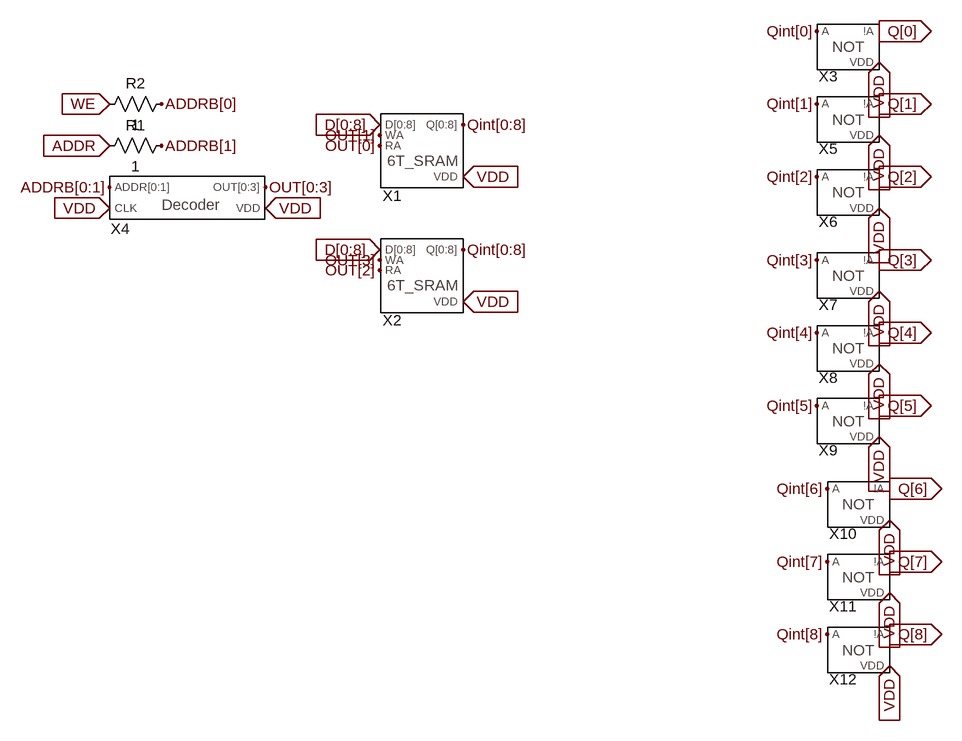
[diagram p0: schematic SRAM.asc]
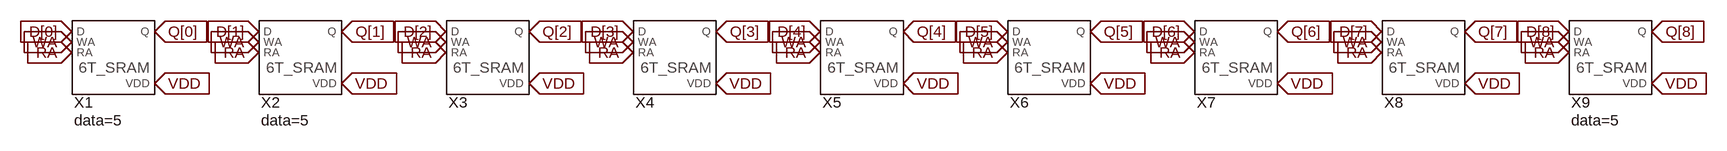
[diagram p1: sub-circuit 6tsram[9].asc]
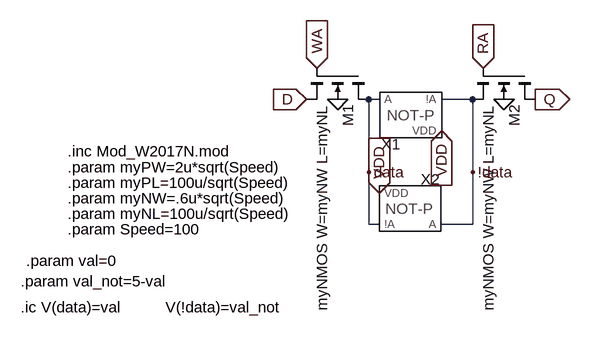
[diagram p2: sub-circuit 6tsram.asc]
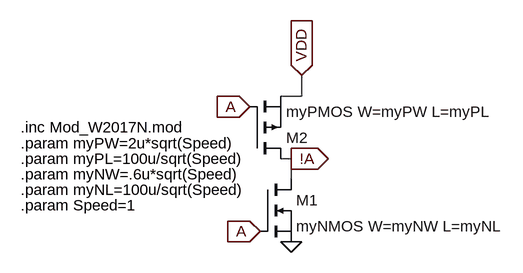
[diagram p3: sub-circuit gate_not_param.asc]
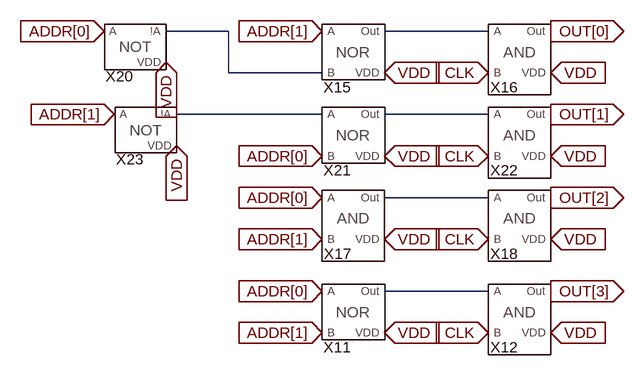
[diagram p4: sub-circuit decoder.asc]
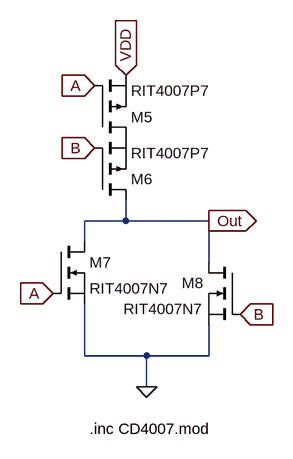
[diagram p5: sub-circuit gate_nor.asc]
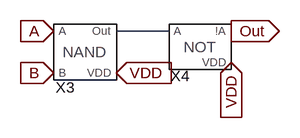
[diagram p6: sub-circuit gate_and.asc]
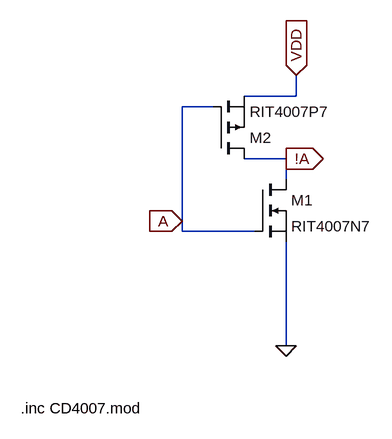
[diagram p7: sub-circuit gate_not.asc]
SRAM.asc, the LTspice schematic file:
Version 4
SHEET 1 1788 680
FLAG 64 -272 VDD
IOPIN 64 -272 In
FLAG 64 -464 VDD
IOPIN 64 -464 In
FLAG -64 -544 D[0:8]
IOPIN -64 -544 In
FLAG -64 -352 D[0:8]
IOPIN -64 -352 In
FLAG 64 -544 Qint[0:8]
FLAG 64 -352 Qint[0:8]
FLAG -480 -448 ADDRB[0:1]
FLAG -400 -512 ADDRB[1]
FLAG -400 -576 ADDRB[0]
FLAG -240 -448 OUT[0:3]
FLAG -240 -416 VDD
IOPIN -240 -416 In
FLAG -480 -576 WE
IOPIN -480 -576 In
FLAG -480 -416 VDD
IOPIN -480 -416 In
FLAG -480 -512 ADDR
IOPIN -480 -512 In
FLAG -64 -528 OUT[1]
FLAG -64 -512 OUT[0]
FLAG -64 -336 OUT[3]
FLAG -64 -320 OUT[2]
FLAG 704 -640 VDD
IOPIN 704 -640 In
FLAG 608 -688 Qint[0]
FLAG 704 -688 Q[0]
IOPIN 704 -688 Out
FLAG 704 -528 VDD
IOPIN 704 -528 In
FLAG 608 -576 Qint[1]
FLAG 704 -576 Q[1]
IOPIN 704 -576 Out
FLAG 704 -416 VDD
IOPIN 704 -416 In
FLAG 608 -464 Qint[2]
FLAG 704 -464 Q[2]
IOPIN 704 -464 Out
FLAG 704 -288 VDD
IOPIN 704 -288 In
FLAG 608 -336 Qint[3]
FLAG 704 -336 Q[3]
IOPIN 704 -336 Out
FLAG 704 -176 VDD
IOPIN 704 -176 In
FLAG 608 -224 Qint[4]
FLAG 704 -224 Q[4]
IOPIN 704 -224 Out
FLAG 704 -64 VDD
IOPIN 704 -64 In
FLAG 608 -112 Qint[5]
FLAG 704 -112 Q[5]
IOPIN 704 -112 Out
FLAG 720 64 VDD
IOPIN 720 64 In
FLAG 624 16 Qint[6]
FLAG 720 16 Q[6]
IOPIN 720 16 Out
FLAG 720 176 VDD
IOPIN 720 176 In
FLAG 624 128 Qint[7]
FLAG 720 128 Q[7]
IOPIN 720 128 Out
FLAG 720 288 VDD
IOPIN 720 288 In
FLAG 624 240 Qint[8]
FLAG 720 240 Q[8]
IOPIN 720 240 Out
SYMBOL 6TSRAM[9] -16 -512 R0
SYMATTR InstName X1
SYMBOL 6TSRAM[9] -16 -320 R0
SYMATTR InstName X2
SYMBOL Decoder -432 -416 R0
SYMATTR InstName X4
SYMBOL res -384 -528 R90
WINDOW 0 0 56 VBottom 2
WINDOW 3 32 56 VTop 2
SYMATTR InstName R1
SYMATTR Value 1
SYMBOL res -384 -592 R90
WINDOW 0 0 56 VBottom 2
WINDOW 3 32 56 VTop 2
SYMATTR InstName R2
SYMATTR Value 1
SYMBOL Gate_NOT 656 -656 R0
SYMATTR InstName X3
SYMBOL Gate_NOT 656 -544 R0
SYMATTR InstName X5
SYMBOL Gate_NOT 656 -432 R0
SYMATTR InstName X6
SYMBOL Gate_NOT 656 -304 R0
SYMATTR InstName X7
SYMBOL Gate_NOT 656 -192 R0
SYMATTR InstName X8
SYMBOL Gate_NOT 656 -80 R0
SYMATTR InstName X9
SYMBOL Gate_NOT 672 48 R0
SYMATTR InstName X10
SYMBOL Gate_NOT 672 160 R0
SYMATTR InstName X11
SYMBOL Gate_NOT 672 272 R0
SYMATTR InstName X12

6tsram[9].asc, the sub-circuit schematic file:
Version 4
SHEET 1 1796 680
FLAG -624 -272 VDD
IOPIN -624 -272 In
FLAG -624 -352 Q[0]
IOPIN -624 -352 In
FLAG -752 -352 D[0]
IOPIN -752 -352 In
FLAG -752 -336 WA
IOPIN -752 -336 In
FLAG -752 -320 RA
IOPIN -752 -320 In
FLAG -336 -272 VDD
IOPIN -336 -272 In
FLAG -336 -352 Q[1]
IOPIN -336 -352 In
FLAG -464 -352 D[1]
IOPIN -464 -352 In
FLAG -464 -336 WA
IOPIN -464 -336 In
FLAG -464 -320 RA
IOPIN -464 -320 In
FLAG -48 -272 VDD
IOPIN -48 -272 In
FLAG -48 -352 Q[2]
IOPIN -48 -352 In
FLAG -176 -352 D[2]
IOPIN -176 -352 In
FLAG -176 -336 WA
IOPIN -176 -336 In
FLAG -176 -320 RA
IOPIN -176 -320 In
FLAG 240 -272 VDD
IOPIN 240 -272 In
FLAG 240 -352 Q[3]
IOPIN 240 -352 In
FLAG 112 -352 D[3]
IOPIN 112 -352 In
FLAG 112 -336 WA
IOPIN 112 -336 In
FLAG 112 -320 RA
IOPIN 112 -320 In
FLAG 528 -272 VDD
IOPIN 528 -272 In
FLAG 528 -352 Q[4]
IOPIN 528 -352 In
FLAG 400 -352 D[4]
IOPIN 400 -352 In
FLAG 400 -336 WA
IOPIN 400 -336 In
FLAG 400 -320 RA
IOPIN 400 -320 In
FLAG 816 -272 VDD
IOPIN 816 -272 In
FLAG 816 -352 Q[5]
IOPIN 816 -352 In
FLAG 688 -352 D[5]
IOPIN 688 -352 In
FLAG 688 -336 WA
IOPIN 688 -336 In
FLAG 688 -320 RA
IOPIN 688 -320 In
FLAG 1104 -272 VDD
IOPIN 1104 -272 In
FLAG 1104 -352 Q[6]
IOPIN 1104 -352 In
FLAG 976 -352 D[6]
IOPIN 976 -352 In
FLAG 976 -336 WA
IOPIN 976 -336 In
FLAG 976 -320 RA
IOPIN 976 -320 In
FLAG 1392 -272 VDD
IOPIN 1392 -272 In
FLAG 1392 -352 Q[7]
IOPIN 1392 -352 In
FLAG 1264 -352 D[7]
IOPIN 1264 -352 In
FLAG 1264 -336 WA
IOPIN 1264 -336 In
FLAG 1264 -320 RA
IOPIN 1264 -320 In
FLAG 1680 -272 VDD
IOPIN 1680 -272 In
FLAG 1680 -352 Q[8]
IOPIN 1680 -352 In
FLAG 1552 -352 D[8]
IOPIN 1552 -352 In
FLAG 1552 -336 WA
IOPIN 1552 -336 In
FLAG 1552 -320 RA
IOPIN 1552 -320 In
SYMBOL 6TSRAM -704 -320 R0
WINDOW 39 -44 105 Left 2
SYMATTR InstName X1
SYMATTR SpiceLine data=5
SYMBOL 6TSRAM -416 -320 R0
WINDOW 39 -44 105 Left 2
SYMATTR InstName X2
SYMATTR SpiceLine data=5
SYMBOL 6TSRAM -128 -320 R0
SYMATTR InstName X3
SYMBOL 6TSRAM 160 -320 R0
SYMATTR InstName X4
SYMBOL 6TSRAM 448 -320 R0
SYMATTR InstName X5
SYMBOL 6TSRAM 736 -320 R0
SYMATTR InstName X6
SYMBOL 6TSRAM 1024 -320 R0
SYMATTR InstName X7
SYMBOL 6TSRAM 1312 -320 R0
SYMATTR InstName X8
SYMBOL 6TSRAM 1600 -320 R0
WINDOW 39 -44 105 Left 2
SYMATTR InstName X9
SYMATTR SpiceLine data=5

6tsram.asc, the sub-circuit schematic file:
Version 4
SHEET 1 880 680
WIRE 16 -64 0 -64
WIRE 160 -64 112 -64
WIRE 0 48 0 -64
WIRE 160 48 160 -64
WIRE 0 128 0 48
WIRE 16 128 0 128
WIRE 160 128 160 48
WIRE 160 128 112 128
FLAG 112 -16 VDD
IOPIN 112 -16 In
FLAG 16 80 VDD
IOPIN 16 80 In
FLAG 256 -64 Q
IOPIN 256 -64 Out
FLAG 208 -64 0
FLAG -48 -64 0
FLAG -80 -112 WA
IOPIN -80 -112 In
FLAG 176 -112 RA
IOPIN 176 -112 In
FLAG -96 -64 D
IOPIN -96 -64 In
FLAG 0 48 data
FLAG 160 48 !data
SYMBOL Gate_NOT_PARAM 64 -32 R0
SYMATTR InstName X1
SYMBOL Gate_NOT_PARAM 64 96 R180
SYMATTR InstName X2
SYMBOL nmos4 0 -112 R90
SYMATTR InstName M1
SYMATTR Value myNMOS W=myNW L=myNL
SYMBOL nmos4 256 -112 R90
SYMATTR InstName M2
SYMATTR Value myNMOS W=myNW L=myNL
TEXT -464 16 Left 2 !.inc Mod_W2017N.mod
TEXT -464 40 Left 2 !.param myPW=2u*sqrt(Speed)
TEXT -464 64 Left 2 !.param myPL=100u/sqrt(Speed)
TEXT -464 88 Left 2 !.param myNW=.6u*sqrt(Speed)
TEXT -464 112 Left 2 !.param myNL=100u/sqrt(Speed)
TEXT -464 136 Left 2 !.param Speed=100
TEXT -536 216 Left 2 !.param val_not=5-val
TEXT -536 256 Left 2 !.ic V(data)=val          V(!data)=val_not
TEXT -528 184 Left 2 !.param val=0

gate_not_param.asc, the sub-circuit schematic file:
Version 4
SHEET 1 880 680
WIRE 64 -112 64 -144
WIRE 64 -112 32 -112
WIRE 48 -16 32 -16
WIRE 48 16 48 -16
FLAG 48 -16 !A
IOPIN 48 -16 Out
FLAG 64 -144 VDD
IOPIN 64 -144 In
FLAG 48 112 0
FLAG 0 96 A
IOPIN 0 96 In
FLAG -16 -96 A
IOPIN -16 -96 In
SYMBOL nmos 0 16 R0
SYMATTR InstName M1
SYMATTR Value myNMOS W=myNW L=myNL
SYMBOL pmos -16 -16 M180
SYMATTR InstName M2
SYMATTR Value myPMOS W=myPW L=myPL
TEXT -368 -64 Left 2 !.inc Mod_W2017N.mod
TEXT -368 -40 Left 2 !.param myPW=2u*sqrt(Speed)
TEXT -368 -16 Left 2 !.param myPL=100u/sqrt(Speed)
TEXT -368 8 Left 2 !.param myNW=.6u*sqrt(Speed)
TEXT -368 32 Left 2 !.param myNL=100u/sqrt(Speed)
TEXT -368 56 Left 2 !.param Speed=1

decoder.asc, the sub-circuit schematic file:
Version 4
SHEET 1 1132 1208
WIRE -688 112 -784 112
WIRE -288 112 -448 112
WIRE -688 176 -688 112
WIRE -544 176 -688 176
WIRE -544 240 -768 240
WIRE -288 240 -448 240
WIRE -288 368 -448 368
WIRE -288 512 -448 512
FLAG -544 512 ADDR[0]
IOPIN -544 512 In
FLAG -544 576 ADDR[1]
IOPIN -544 576 In
FLAG -448 576 VDD
IOPIN -448 576 In
FLAG -288 576 CLK
IOPIN -288 576 In
FLAG -192 576 VDD
IOPIN -192 576 In
FLAG -544 112 ADDR[1]
IOPIN -544 112 In
FLAG -880 112 ADDR[0]
IOPIN -880 112 In
FLAG -784 160 VDD
IOPIN -784 160 In
FLAG -288 176 CLK
IOPIN -288 176 In
FLAG -192 176 VDD
IOPIN -192 176 In
FLAG -544 368 ADDR[0]
IOPIN -544 368 In
FLAG -544 432 ADDR[1]
IOPIN -544 432 In
FLAG -448 432 VDD
IOPIN -448 432 In
FLAG -288 432 CLK
IOPIN -288 432 In
FLAG -192 432 VDD
IOPIN -192 432 In
FLAG -864 240 ADDR[1]
IOPIN -864 240 In
FLAG -544 304 ADDR[0]
IOPIN -544 304 In
FLAG -768 288 VDD
IOPIN -768 288 In
FLAG -288 304 CLK
IOPIN -288 304 In
FLAG -192 304 VDD
IOPIN -192 304 In
FLAG -448 304 VDD
IOPIN -448 304 In
FLAG -448 176 VDD
IOPIN -448 176 In
FLAG -192 512 OUT[3]
IOPIN -192 512 Out
FLAG -192 112 OUT[0]
IOPIN -192 112 Out
FLAG -192 240 OUT[1]
IOPIN -192 240 Out
FLAG -192 368 OUT[2]
IOPIN -192 368 Out
SYMBOL Gate_NOR -496 544 R0
SYMATTR InstName X11
SYMBOL Gate_AND -240 544 R0
SYMATTR InstName X12
SYMBOL Gate_NOR -496 144 R0
SYMATTR InstName X15
SYMBOL Gate_AND -240 144 R0
SYMATTR InstName X16
SYMBOL Gate_AND -240 400 R0
SYMATTR InstName X18
SYMBOL Gate_AND -496 400 R0
SYMATTR InstName X17
SYMBOL Gate_NOT -832 144 R0
SYMATTR InstName X20
SYMBOL Gate_NOR -496 272 R0
SYMATTR InstName X21
SYMBOL Gate_AND -240 272 R0
SYMATTR InstName X22
SYMBOL Gate_NOT -816 272 R0
SYMATTR InstName X23

gate_nor.asc, the sub-circuit schematic file:
Version 4
SHEET 1 880 680
WIRE -656 -80 -656 -112
WIRE -656 -80 -720 -80
WIRE -528 -80 -656 -80
WIRE -720 -48 -720 -80
WIRE -528 -16 -528 -80
WIRE -720 128 -720 48
WIRE -624 128 -720 128
WIRE -528 128 -528 80
WIRE -528 128 -624 128
WIRE -624 176 -624 128
FLAG -656 -304 VDD
IOPIN -656 -304 In
FLAG -528 -80 Out
IOPIN -528 -80 Out
FLAG -704 -288 A
IOPIN -704 -288 In
FLAG -768 32 A
IOPIN -768 32 In
FLAG -480 64 B
IOPIN -480 64 In
FLAG -704 -192 B
IOPIN -704 -192 In
FLAG -624 176 0
SYMBOL pmos -704 -208 M180
SYMATTR InstName M5
SYMATTR Value RIT4007P7
SYMBOL pmos -704 -112 M180
SYMATTR InstName M6
SYMATTR Value RIT4007P7
SYMBOL nmos -768 -48 R0
SYMATTR InstName M7
SYMATTR Value RIT4007N7
SYMBOL nmos -480 -16 M0
SYMATTR InstName M8
SYMATTR Value RIT4007N7
TEXT -712 240 Left 2 !.inc CD4007.mod

gate_and.asc, the sub-circuit schematic file:
Version 4
SHEET 1 880 680
WIRE -144 0 -224 0
FLAG -224 64 VDD
IOPIN -224 64 In
FLAG -48 48 VDD
IOPIN -48 48 In
FLAG -320 64 B
IOPIN -320 64 In
FLAG -320 0 A
IOPIN -320 0 In
FLAG -48 0 Out
IOPIN -48 0 Out
SYMBOL Gate_NAND -272 32 R0
SYMATTR InstName X3
SYMBOL Gate_NOT -96 32 R0
SYMATTR InstName X4

gate_not.asc, the sub-circuit schematic file:
Version 4
SHEET 1 880 680
WIRE 64 -112 64 -144
WIRE 64 -112 -16 -112
WIRE -64 -96 -112 -96
WIRE 48 -16 -16 -16
WIRE 48 16 48 -16
WIRE -112 80 -112 -96
WIRE -112 96 -112 80
WIRE 0 96 -112 96
WIRE 48 272 48 112
FLAG 48 272 0
FLAG -112 80 A
IOPIN -112 80 In
FLAG 48 -16 !A
IOPIN 48 -16 Out
FLAG 64 -144 VDD
IOPIN 64 -144 In
SYMBOL nmos 0 16 R0
SYMATTR InstName M1
SYMATTR Value RIT4007N7
SYMBOL pmos -64 -16 M180
SYMATTR InstName M2
SYMATTR Value RIT4007P7
TEXT -360 368 Left 2 !.inc CD4007.mod

The netlist it stands for:
* SRAM.asc
XX1 D[0] D[1] D[2] D[3] D[4] D[5] D[6] D[7] D[8] VDD Qint[0] Qint[1] Qint[2] Qint[3] Qint[4] Qint[5] Qint[6] Qint[7] Qint[8] OUT[0] OUT[1] 6tsram[9]
XX2 D[0] D[1] D[2] D[3] D[4] D[5] D[6] D[7] D[8] VDD Qint[0] Qint[1] Qint[2] Qint[3] Qint[4] Qint[5] Qint[6] Qint[7] Qint[8] OUT[2] OUT[3] 6tsram[9]
XX4 VDD VDD OUT[0] OUT[1] OUT[2] OUT[3] ADDRB[0] ADDRB[1] decoder
R1 ADDRB[1] ADDR 1
R2 ADDRB[0] WE 1
XX3 Qint[0] VDD Q[0] gate_not
XX5 Qint[1] VDD Q[1] gate_not
XX6 Qint[2] VDD Q[2] gate_not
XX7 Qint[3] VDD Q[3] gate_not
XX8 Qint[4] VDD Q[4] gate_not
XX9 Qint[5] VDD Q[5] gate_not
XX10 Qint[6] VDD Q[6] gate_not
XX11 Qint[7] VDD Q[7] gate_not
XX12 Qint[8] VDD Q[8] gate_not

* block symbol definitions
.subckt 6tsram[9] D[0] D[1] D[2] D[3] D[4] D[5] D[6] D[7] D[8] VDD Q[0] Q[1] Q[2] Q[3] Q[4] Q[5] Q[6] Q[7] Q[8] RA WA
XX1 D[0] VDD Q[0] RA WA 6tsram params: data=5
XX2 D[1] VDD Q[1] RA WA 6tsram params: data=5
XX3 D[2] VDD Q[2] RA WA 6tsram
XX4 D[3] VDD Q[3] RA WA 6tsram
XX5 D[4] VDD Q[4] RA WA 6tsram
XX6 D[5] VDD Q[5] RA WA 6tsram
XX7 D[6] VDD Q[6] RA WA 6tsram
XX8 D[7] VDD Q[7] RA WA 6tsram
XX9 D[8] VDD Q[8] RA WA 6tsram params: data=5
.ends 6tsram[9]

.subckt 6tsram D VDD Q RA WA
XX1 data VDD !data gate_not_param
XX2 !data VDD data gate_not_param
M1 data WA D 0 myNMOS W=myNW L=myNL
M2 Q RA !data 0 myNMOS W=myNW L=myNL
.inc Mod_W2017N.mod
.param myPW=2u*sqrt(Speed)
.param myPL=100u/sqrt(Speed)
.param myNW=.6u*sqrt(Speed)
.param myNL=100u/sqrt(Speed)
.param Speed=100
.param val_not=5-val
.ic V(data)=val          V(!data)=val_not
.param val=0
.ends 6tsram

.subckt gate_not_param A VDD !A
M1 !A A 0 0 myNMOS W=myNW L=myNL
M2 !A A VDD VDD myPMOS W=myPW L=myPL
.inc Mod_W2017N.mod
.param myPW=2u*sqrt(Speed)
.param myPL=100u/sqrt(Speed)
.param myNW=.6u*sqrt(Speed)
.param myNL=100u/sqrt(Speed)
.param Speed=1
.ends gate_not_param

.subckt decoder CLK VDD OUT[0] OUT[1] OUT[2] OUT[3] ADDR[0] ADDR[1]
XX11 ADDR[0] ADDR[1] N006 VDD gate_nor
XX12 N006 CLK OUT[3] VDD gate_and
XX15 ADDR[1] N001 N002 VDD gate_nor
XX16 N002 CLK OUT[0] VDD gate_and
XX18 N005 CLK OUT[2] VDD gate_and
XX17 ADDR[0] ADDR[1] N005 VDD gate_and
XX20 ADDR[0] VDD N001 gate_not
XX21 N003 ADDR[0] N004 VDD gate_nor
XX22 N004 CLK OUT[1] VDD gate_and
XX23 ADDR[1] VDD N003 gate_not
.ends decoder

.subckt gate_nor A B Out VDD
M5 P001 A VDD VDD RIT4007P7
M6 Out B P001 P001 RIT4007P7
M7 Out A 0 0 RIT4007N7
M8 Out B 0 0 RIT4007N7
.inc CD4007.mod
.ends gate_nor

.subckt gate_and A B Out VDD
XX3 A B N001 VDD Gate_NAND  ; pins A B Out VDD
XX4 N001 VDD Out gate_not
.ends gate_and

.subckt gate_not A VDD !A
M1 !A A 0 0 RIT4007N7
M2 !A A VDD VDD RIT4007P7
.inc CD4007.mod
.ends gate_not

.model NMOS NMOS
.model PMOS PMOS
.lib standard.mos
.backanno
.end